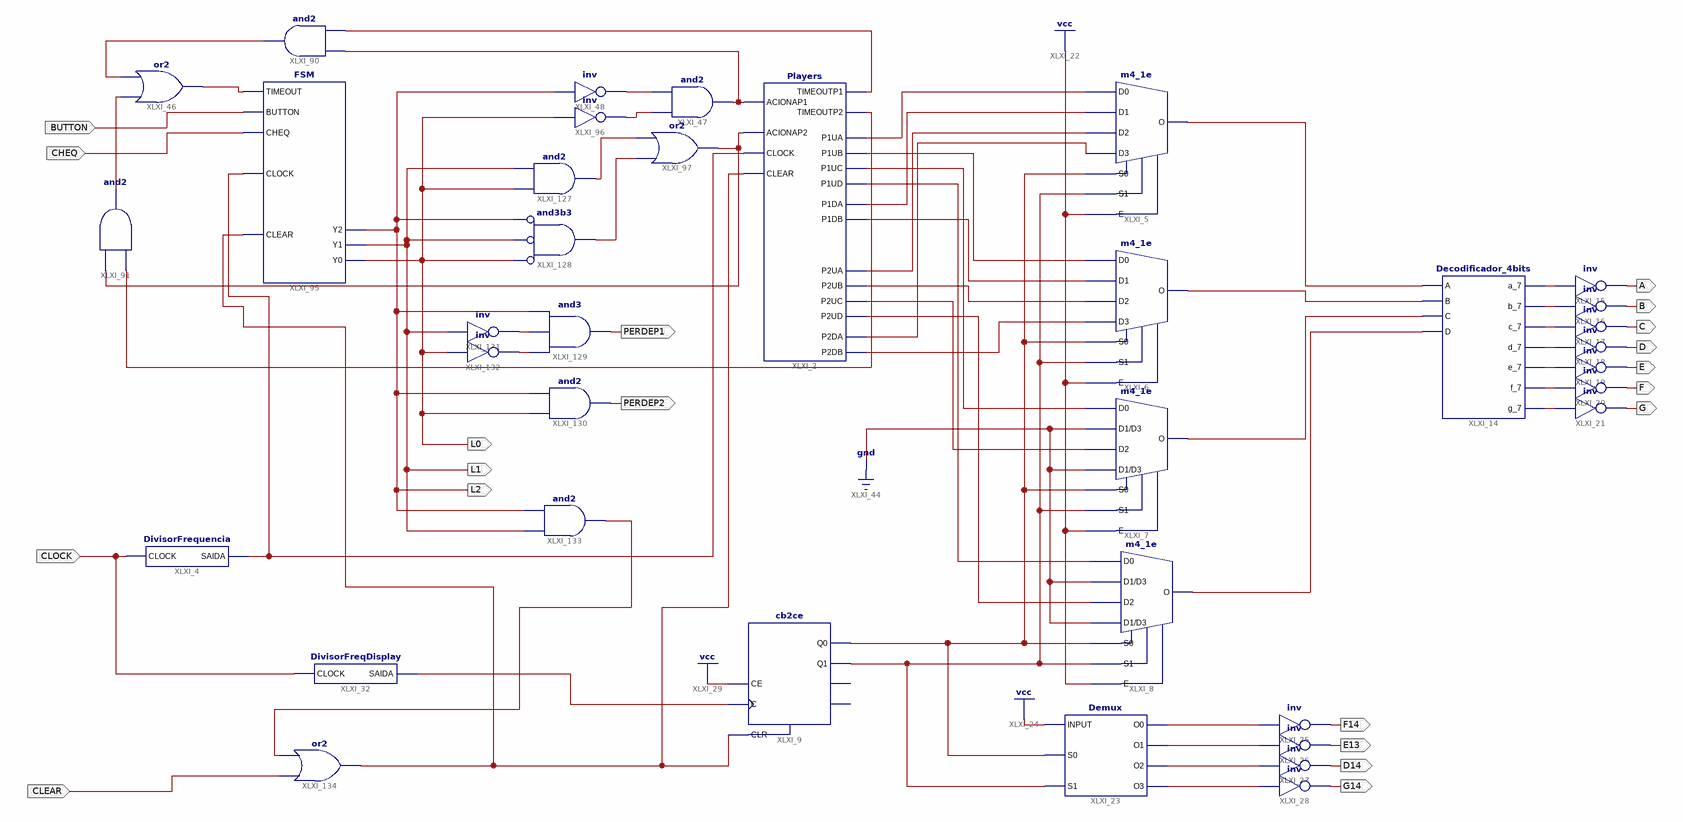
[diagram p0: schematic sheet 1]
// Xilinx ISE schematic System.sch (spartan3) as structural Verilog: 37 symbols, 20 ports
module System (
  input  CLOCK,
  input  BUTTON,
  input  CHEQ,
  input  CLEAR,
  output A,
  output B,
  output C,
  output D,
  output E,
  output F,
  output G,
  output G14,
  output E13,
  output F14,
  output D14,
  output L2,
  output L0,
  output PERDEP2,
  output PERDEP1,
  output L1
);

  wire XLXN_77, XLXN_78, XLXN_79, XLXN_80, XLXN_81, XLXN_82, XLXN_83, XLXN_84, XLXN_85, XLXN_87, XLXN_104,
       XLXN_105, XLXN_106, XLXN_107, XLXN_108, XLXN_109, XLXN_110, XLXN_149, XLXN_195, XLXN_196, XLXN_200,
       XLXN_205, XLXN_206, XLXN_216, XLXN_217, XLXN_218, XLXN_219, XLXN_220, XLXN_221, XLXN_222, XLXN_223,
       XLXN_237, XLXN_238, XLXN_329, XLXN_338, XLXN_341, XLXN_342, XLXN_343, XLXN_347, XLXN_349, XLXN_436,
       XLXN_437, XLXN_438, XLXN_439, XLXN_455, XLXN_456;

  Players XLXI_2 (
    .CLEAR(XLXN_456), .ACIONAP1(XLXN_237), .ACIONAP2(XLXN_329), .CLOCK(XLXN_347), .TIMEOUTP1(XLXN_341),
    .P1UA(XLXN_77), .P1UB(XLXN_81), .P1UC(XLXN_85), .P1UD(XLXN_87), .P1DA(XLXN_78), .P1DB(XLXN_82),
    .P2UD(XLXN_196), .P2UC(XLXN_195), .P2UB(XLXN_83), .P2UA(XLXN_79), .P2DA(XLXN_80), .P2DB(XLXN_84),
    .TIMEOUTP2(XLXN_343));
  m4_1e XLXI_5 (
    .D0(XLXN_77), .D1(XLXN_78), .D2(XLXN_79), .D3(XLXN_80), .E(1'b1), .S0(XLXN_200), .S1(XLXN_205),
    .O(XLXN_220));
  m4_1e XLXI_6 (
    .D0(XLXN_81), .D1(XLXN_82), .D2(XLXN_83), .D3(XLXN_84), .E(1'b1), .S0(XLXN_200), .S1(XLXN_205),
    .O(XLXN_221));
  m4_1e XLXI_7 (
    .D0(XLXN_85), .D1(1'b0), .D2(XLXN_195), .D3(1'b0), .E(1'b1), .S0(XLXN_200), .S1(XLXN_205), .O(XLXN_222));
  m4_1e XLXI_8 (
    .D0(XLXN_87), .D1(1'b0), .D2(XLXN_196), .D3(1'b0), .E(1'b1), .S0(XLXN_200), .S1(XLXN_205), .O(XLXN_223));
  Decodificador_4bits XLXI_14 (
    .a_7(XLXN_104), .b_7(XLXN_105), .c_7(XLXN_106), .d_7(XLXN_107), .e_7(XLXN_108), .f_7(XLXN_109),
    .g_7(XLXN_110), .A(XLXN_220), .B(XLXN_221), .C(XLXN_222), .D(XLXN_223));
  not XLXI_15 (A, XLXN_104);
  not XLXI_16 (B, XLXN_105);
  not XLXI_17 (C, XLXN_106);
  not XLXI_18 (D, XLXN_107);
  not XLXI_19 (E, XLXN_108);
  not XLXI_20 (F, XLXN_109);
  not XLXI_21 (G, XLXN_110);
  cb2ce XLXI_9 (.C(XLXN_149), .CE(1'b1), .CLR(XLXN_456), .Q0(XLXN_200), .Q1(XLXN_205));  // open: CEO, TC
  not XLXI_25 (F14, XLXN_216);
  not XLXI_26 (E13, XLXN_217);
  not XLXI_27 (D14, XLXN_218);
  not XLXI_28 (G14, XLXN_219);
  Demux XLXI_23 (
    .INPUT(1'b1), .S0(XLXN_200), .S1(XLXN_205), .O0(XLXN_216), .O1(XLXN_217), .O2(XLXN_218), .O3(XLXN_219));
  and XLXI_47 (XLXN_237, XLXN_349, XLXN_238);
  not XLXI_48 (XLXN_238, L2);
  not XLXI_96 (XLXN_349, L0);
  or XLXI_97 (XLXN_329, XLXN_437, XLXN_436);
  DivisorFrequencia XLXI_4 (.CLOCK(CLOCK), .SAIDA(XLXN_347));
  DivisorFreqDisplay XLXI_32 (.CLOCK(CLOCK), .SAIDA(XLXN_149));
  and XLXI_90 (XLXN_338, XLXN_341, XLXN_237);
  and XLXI_91 (XLXN_342, XLXN_343, XLXN_329);
  FSM XLXI_95 (
    .CHEQ(CHEQ), .TIMEOUT(XLXN_206), .BUTTON(BUTTON), .CLOCK(XLXN_347), .CLEAR(XLXN_456), .Y2(L2), .Y0(L0),
    .Y1(L1));
  or XLXI_46 (XLXN_206, XLXN_342, XLXN_338);
  and XLXI_127 (XLXN_436, L0, L1);
  and XLXI_128 (XLXN_437, ~L0, ~L1, ~L2);  // and3b3
  and XLXI_129 (PERDEP1, XLXN_439, XLXN_438, L2);
  and XLXI_130 (PERDEP2, L0, L2);
  not XLXI_131 (XLXN_438, L1);
  not XLXI_132 (XLXN_439, L0);
  and XLXI_133 (XLXN_455, L1, L2);
  or XLXI_134 (XLXN_456, CLEAR, XLXN_455);
endmodule
